# Altium schematic sheet memory.SCHDOC
size B
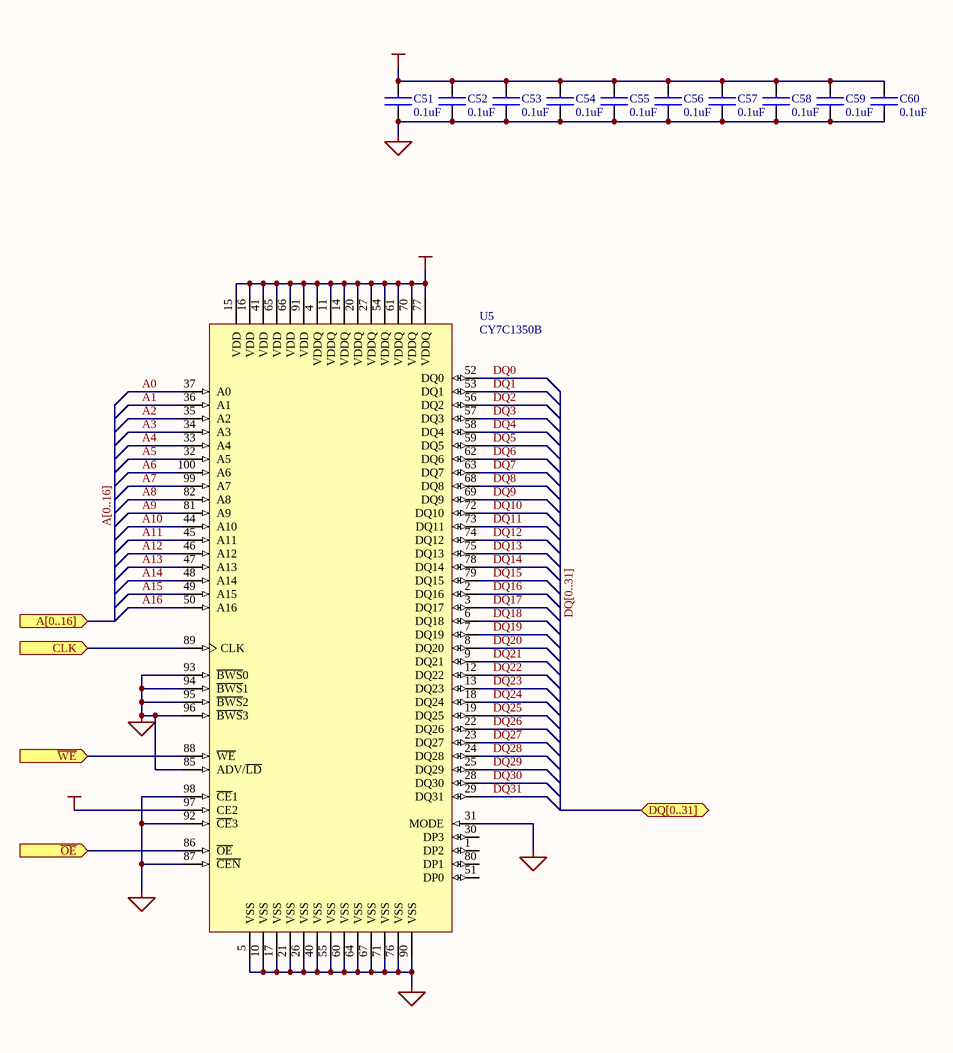
[diagram p0: memory.SCHDOC]

## Parts
C51  value 0.1uF  [0603]  (hidden comment: CAPACITOR)
C52  value 0.1uF  [0603]  (hidden comment: CAPACITOR)
C53  value 0.1uF  [0603]  (hidden comment: CAPACITOR)
C54  value 0.1uF  [0603]  (hidden comment: CAPACITOR)
C55  value 0.1uF  [0603]  (hidden comment: CAPACITOR)
C56  value 0.1uF  [0603]  (hidden comment: CAPACITOR)
C57  value 0.1uF  [0603]  (hidden comment: CAPACITOR)
C58  value 0.1uF  [0603]  (hidden comment: CAPACITOR)
C59  value 0.1uF  [0603]  (hidden comment: CAPACITOR)
C60  value 0.1uF  [0603]  (hidden comment: CAPACITOR)
U5  CY7C1350B  [R-QFP14x20-G100/N]

## Ports
A[0..16] (in), CLK (in), DQ[0..31] (bidir), ~{OE} (in), ~{WE} (in)

## Nets
GND: C51.1 C52.1 C53.1 C54.1 C55.1 C56.1 C57.1 C58.1 C59.1 C60.2 U5.5(VSS) U5.10(VSS) U5.17(VSS) U5.21(VSS) U5.26(VSS) U5.31(MODE) U5.40(VSS) U5.55(VSS) U5.60(VSS) U5.64(VSS) U5.67(VSS) U5.71(VSS) U5.76(VSS) U5.85(ADV/~{LD}) U5.87(~{CEN}) U5.90(VSS) U5.92(~{CE}3) U5.93(~{BWS}0) U5.94(~{BWS}1) U5.95(~{BWS}2) U5.96(~{BWS}3) U5.98(~{CE}1)
VCC: C51.2 C52.2 C53.2 C54.2 C55.2 C56.2 C57.2 C58.2 C59.2 C60.1 U5.4(VDDQ) U5.11(VDDQ) U5.14(VDDQ) U5.15(VDD) U5.16(VDD) U5.20(VDDQ) U5.27(VDDQ) U5.41(VDD) U5.54(VDDQ) U5.61(VDDQ) U5.65(VDD) U5.66(VDD) U5.70(VDDQ) U5.77(VDDQ) U5.91(VDD) U5.97(CE2)
A0: U5.37(A0)
A1: U5.36(A1)
A2: U5.35(A2)
A3: U5.34(A3)
A4: U5.33(A4)
A5: U5.32(A5)
A6: U5.100(A6)
A7: U5.99(A7)
A8: U5.82(A8)
A9: U5.81(A9)
A10: U5.44(A10)
A11: U5.45(A11)
A12: U5.46(A12)
A13: U5.47(A13)
A14: U5.48(A14)
A15: U5.49(A15)
A16: U5.50(A16)
CLK: U5.89(CLK) ; port CLK
DQ0: U5.52(DQ0)
DQ1: U5.53(DQ1)
DQ2: U5.56(DQ2)
DQ3: U5.57(DQ3)
DQ4: U5.58(DQ4)
DQ5: U5.59(DQ5)
DQ6: U5.62(DQ6)
DQ7: U5.63(DQ7)
DQ8: U5.68(DQ8)
DQ9: U5.69(DQ9)
DQ10: U5.72(DQ10)
DQ11: U5.73(DQ11)
DQ12: U5.74(DQ12)
DQ13: U5.75(DQ13)
DQ14: U5.78(DQ14)
DQ15: U5.79(DQ15)
DQ16: U5.2(DQ16)
DQ17: U5.3(DQ17)
DQ18: U5.6(DQ18)
DQ19: U5.7(DQ19)
DQ20: U5.8(DQ20)
DQ21: U5.9(DQ21)
DQ22: U5.12(DQ22)
DQ23: U5.13(DQ23)
DQ24: U5.18(DQ24)
DQ25: U5.19(DQ25)
DQ26: U5.22(DQ26)
DQ27: U5.23(DQ27)
DQ28: U5.24(DQ28)
DQ29: U5.25(DQ29)
DQ30: U5.28(DQ30)
DQ31: U5.29(DQ31)
~{OE}: U5.86(~{OE}) ; port ~{OE}
~{WE}: U5.88(~{WE}) ; port ~{WE}

Not connected (* = marked no-connect by the designer): U5 1(DP2) 30(DP3) 51(DP0) 80(DP1)

## Buses and harness runs
bus A[0..16] = port A[0..16]
bus DQ[0..31] = port DQ[0..31]

## Library data of the parts
C51-C60 = CAPACITOR: Standard Capacitor
U5 = CY7C1350B: Cypress NoBL Pipelined SRAM 128kx36